# EAGLE schematic game-boy-cam-arduino-breakout (EAGLE 6.4)
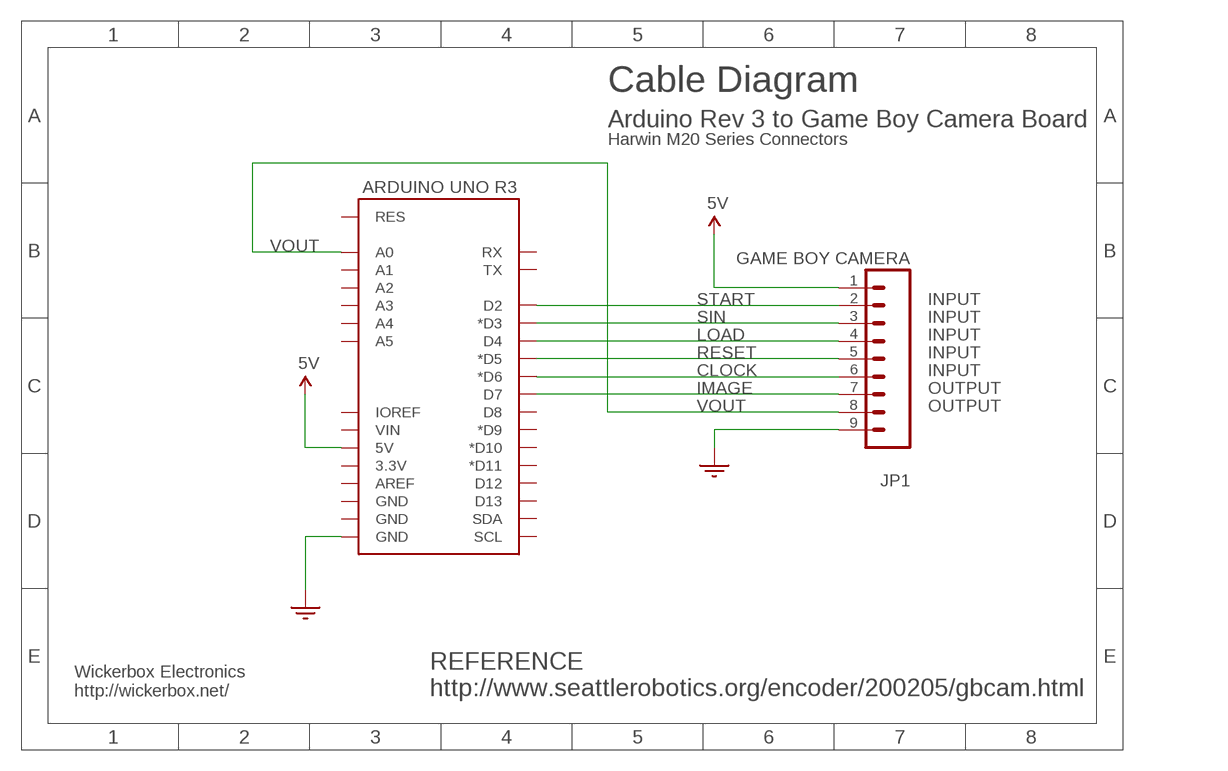
[diagram p0: schematic, sheet 1]

## Parts
ARDUINO1  ARDUINO_R3_SHIELD  [UNO_R3_SHIELD]
JP1  GAME BOY CAMERA  M09  [1X09]

## Nets
5V: ARDUINO1.5V JP1.1
CLOCK: ARDUINO1.D6(*D6) JP1.6
GND: ARDUINO1.GND@0(GND) JP1.9
IMAGE: ARDUINO1.D7 JP1.7
LOAD: ARDUINO1.D4 JP1.4
RESET: ARDUINO1.D5(*D5) JP1.5
SIN: ARDUINO1.D3(*D3) JP1.3
START: ARDUINO1.D2 JP1.2
VOUT: ARDUINO1.A0 JP1.8
Unconnected: ARDUINO1.3.3V ARDUINO1.A1 ARDUINO1.A2 ARDUINO1.A3 ARDUINO1.A4 ARDUINO1.A5 ARDUINO1.AREF ARDUINO1.D8 ARDUINO1.D9(*D9) ARDUINO1.D10(*D10) ARDUINO1.D11(*D11) ARDUINO1.D12 ARDUINO1.D13 ARDUINO1.GND@1(GND) ARDUINO1.GND@2(GND) ARDUINO1.IOREF ARDUINO1.RES ARDUINO1.RX ARDUINO1.SCL ARDUINO1.SDA ARDUINO1.TX ARDUINO1.VIN

## Notes on the sheet
- Cable Diagram
- Arduino Rev 3 to Game Boy Camera Board
- Harwin M20 Series Connectors
- INPUT
- INPUT
- INPUT
- INPUT
- INPUT
- OUTPUT
- OUTPUT
- Wickerbox Electronics
  http://wickerbox.net/
- REFERENCE
  http://www.seattlerobotics.org/encoder/200205/gbcam.html

## Library data of the parts
ARDUINO1 = SparkFun-Boards:ARDUINO_R3_SHIELD: Shield form compatible with the Arduino Uno R3.
JP1 = SparkFun-Connectors:M09: Header 9 Standard 9-pin 0.1" header. Use with straight break away headers (SKU : PRT-00116), right angle break away headers (PRT-00553), swiss pins (PRT-00743), machine pins (PRT-00117), and female headers (PRT-00115).